# Altium schematic sheet EnvironmentalSensor.SchDoc
size A4; SheetNumber: 8; SheetTotal: 15
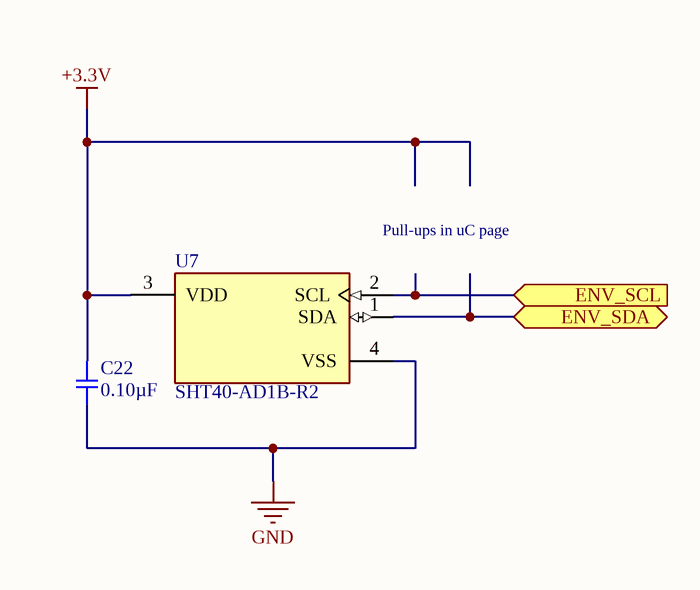
[diagram p0: EnvironmentalSensor.SchDoc]

## Parts
C22  0.10µF  [SMD-0402C]
U7  SHT40-AD1B-R2  [FP-SHT40-AD1B-R2-MFG]

## Ports
ENV_SCL (in), ENV_SDA (bidir)

## Nets
+3.3V: C22.1 U7.3(VDD)
GND: C22.2 U7.4(VSS)
ENV_SCL: U7.2(SCL) ; port ENV_SCL
ENV_SDA: U7.1(SDA) ; port ENV_SDA

## Notes on the sheet
- (near U7) Pull-ups in uC page

## Library data of the parts
C22 = GCM155R71C104KA55D: CAP CER 0.1UF 16V X7R 0402; Manufacturer: Murata Electronics North America; Factory Stock: 0; Unit Price (USD): 0.1; Minimum Quantity: 1; Tolerance: ±10%; Datasheets: http://www.murata.com/~/media/webrenewal/support/library/catalog/products/capacitor/mlcc/c03e.ashx; Image: //media.digikey.com/Renders/Murata%20Renders/ZRB-SERIES-0402.jpg; Digi-Key Part Number: 490-4759-1-ND; Part Number: GCM155R71C104KA55D; Quantity Available: 734194; @ qty: 0; Packaging: Cut Tape (CT); Series: GCM; Part Status: Active; Value: 0.10µF; Voltage: 16V; Temperature Coefficient: X7R; Operating Temperature: -55°C ~ 125°C; Features: -; Ratings: AEC-Q200; Applications: Automotive; Mounting Type: Surface Mount, MLCC; Package / Case: 0402 (1005 Metric); Size / Dimension: 0.039" L x 0.020" W (1.00mm x 0.50mm); Height - Seated (Max): -; Thickness (Max): 0.022" (0.55mm); Lead Spacing: -; Lead Style: -
U7 = CMP-144040-000008-1: SENSOR HUMIDITY 100 RH SMD; Value: SHT40-AD1B-R2